# Altium schematic sheet CAL_logics.SchDoc: Calibration logics
size 420 x 297 mm; CheckedBy: K.Belewicz; DrawnBy: G.Kasprowicz; SheetNumber: 2; SheetTotal: 5; ModifiedBy: -; CheckedDate: 12.06.2022; DivGrp: WUT ISE; Designer: G.Kasprowicz
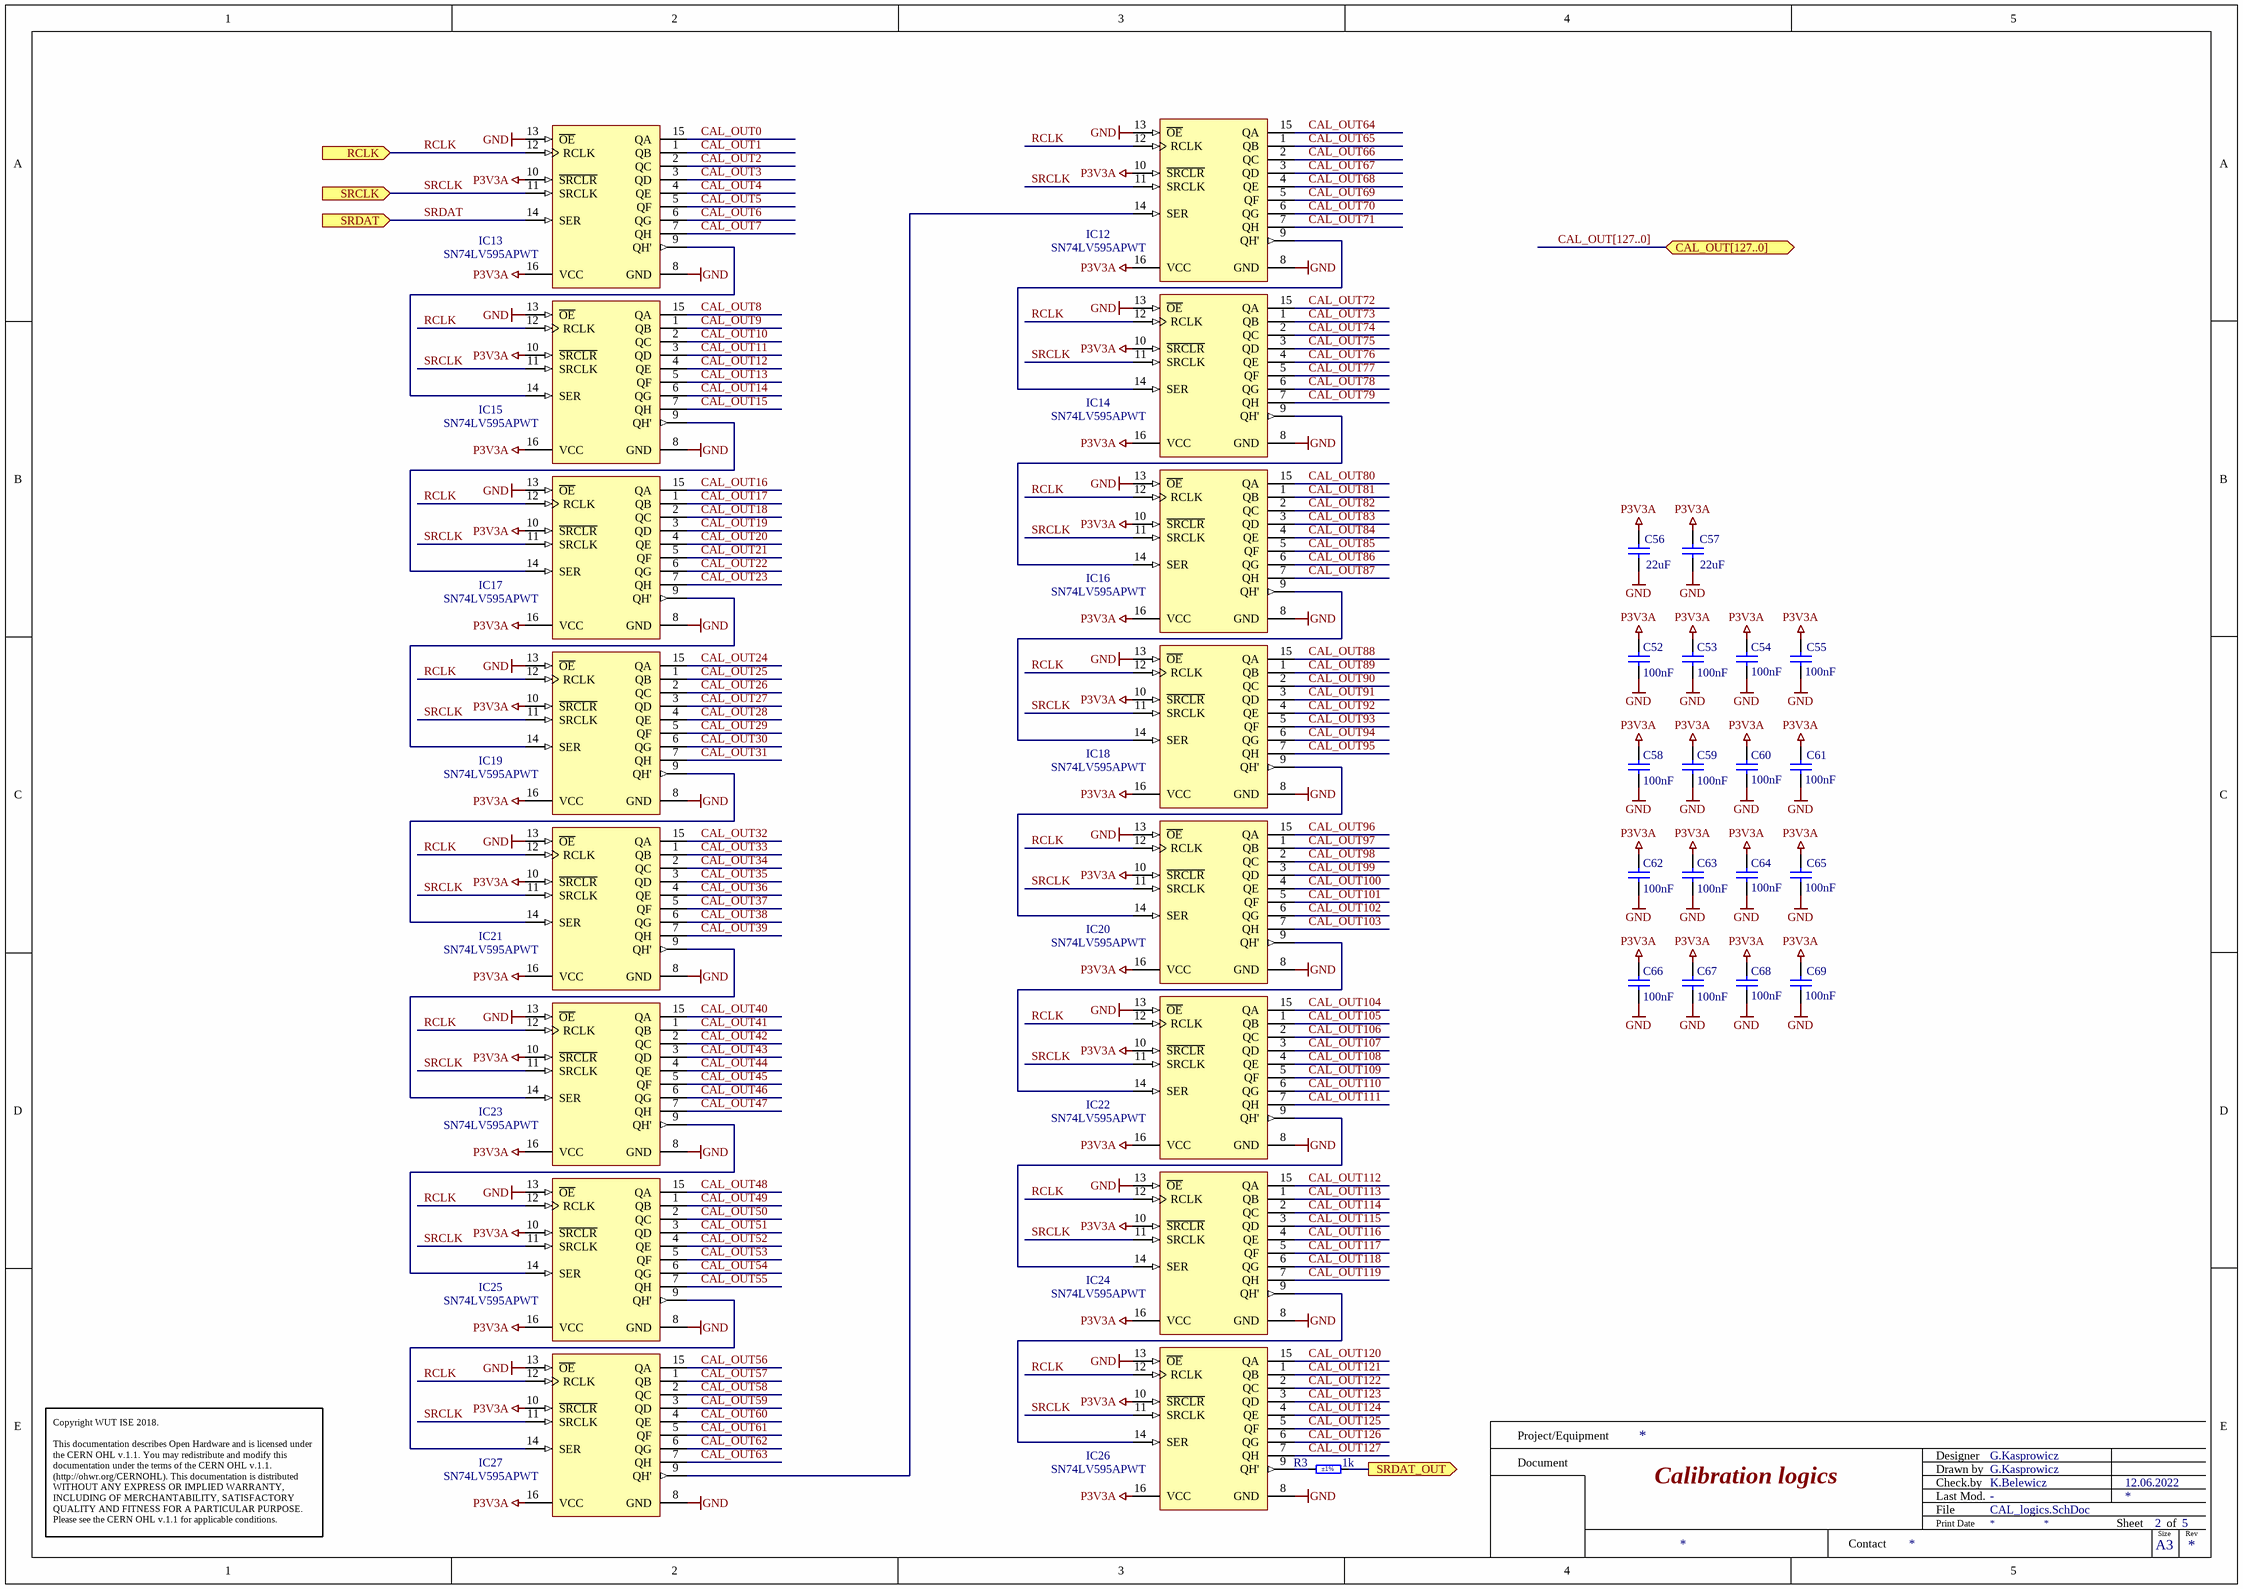
[diagram p0: CAL_logics.SchDoc]

## Parts
C52  100nF  [CAPC1005X55N]
C53  100nF  [CAPC1005X55N]
C54  100nF  [CAPC1005X55N]
C55  100nF  [CAPC1005X55N]
C56  22uF  [CAPC3216X140N]
C57  22uF  [CAPC3216X140N]
C58  100nF  [CAPC1005X55N]
C59  100nF  [CAPC1005X55N]
C60  100nF  [CAPC1005X55N]
C61  100nF  [CAPC1005X55N]
C62  100nF  [CAPC1005X55N]
C63  100nF  [CAPC1005X55N]
C64  100nF  [CAPC1005X55N]
C65  100nF  [CAPC1005X55N]
C66  100nF  [CAPC1005X55N]
C67  100nF  [CAPC1005X55N]
C68  100nF  [CAPC1005X55N]
C69  100nF  [CAPC1005X55N]
IC12  SN74LV595APWT  [SOP65P640X120-16N]
IC13  SN74LV595APWT  [SOP65P640X120-16N]
IC14  SN74LV595APWT  [SOP65P640X120-16N]
IC15  SN74LV595APWT  [SOP65P640X120-16N]
IC16  SN74LV595APWT  [SOP65P640X120-16N]
IC17  SN74LV595APWT  [SOP65P640X120-16N]
IC18  SN74LV595APWT  [SOP65P640X120-16N]
IC19  SN74LV595APWT  [SOP65P640X120-16N]
IC20  SN74LV595APWT  [SOP65P640X120-16N]
IC21  SN74LV595APWT  [SOP65P640X120-16N]
IC22  SN74LV595APWT  [SOP65P640X120-16N]
IC23  SN74LV595APWT  [SOP65P640X120-16N]
IC24  SN74LV595APWT  [SOP65P640X120-16N]
IC25  SN74LV595APWT  [SOP65P640X120-16N]
IC26  SN74LV595APWT  [SOP65P640X120-16N]
IC27  SN74LV595APWT  [SOP65P640X120-16N]
R3  1k  Tolerance: ±1%  [RESC1005X40N]

## Ports
CAL_OUT[127..0] (bidir), RCLK (in), SRCLK (in), SRDAT (in), SRDAT_OUT (out)

## Nets
GND: C52.1 C53.1 C54.1 C55.1 C56.1 C57.1 C58.1 C59.1 C60.1 C61.1 C62.1 C63.1 C64.1 C65.1 C66.1 C67.1 C68.1 C69.1 IC12.8(GND) IC12.13(~{OE}) IC13.8(GND) IC13.13(~{OE}) IC14.8(GND) IC14.13(~{OE}) IC15.8(GND) IC15.13(~{OE}) IC16.8(GND) IC16.13(~{OE}) IC17.8(GND) IC17.13(~{OE}) IC18.8(GND) IC18.13(~{OE}) IC19.8(GND) IC19.13(~{OE}) IC20.8(GND) IC20.13(~{OE}) IC21.8(GND) IC21.13(~{OE}) IC22.8(GND) IC22.13(~{OE}) IC23.8(GND) IC23.13(~{OE}) IC24.8(GND) IC24.13(~{OE}) IC25.8(GND) IC25.13(~{OE}) IC26.8(GND) IC26.13(~{OE}) IC27.8(GND) IC27.13(~{OE})
P3V3A: C52.2 C53.2 C54.2 C55.2 C56.2 C57.2 C58.2 C59.2 C60.2 C61.2 C62.2 C63.2 C64.2 C65.2 C66.2 C67.2 C68.2 C69.2 IC12.10(~{SRCLR}) IC12.16(VCC) IC13.10(~{SRCLR}) IC13.16(VCC) IC14.10(~{SRCLR}) IC14.16(VCC) IC15.10(~{SRCLR}) IC15.16(VCC) IC16.10(~{SRCLR}) IC16.16(VCC) IC17.10(~{SRCLR}) IC17.16(VCC) IC18.10(~{SRCLR}) IC18.16(VCC) IC19.10(~{SRCLR}) IC19.16(VCC) IC20.10(~{SRCLR}) IC20.16(VCC) IC21.10(~{SRCLR}) IC21.16(VCC) IC22.10(~{SRCLR}) IC22.16(VCC) IC23.10(~{SRCLR}) IC23.16(VCC) IC24.10(~{SRCLR}) IC24.16(VCC) IC25.10(~{SRCLR}) IC25.16(VCC) IC26.10(~{SRCLR}) IC26.16(VCC) IC27.10(~{SRCLR}) IC27.16(VCC)
CAL_OUT0: IC13.15(QA)
CAL_OUT1: IC13.1(QB)
CAL_OUT2: IC13.2(QC)
CAL_OUT3: IC13.3(QD)
CAL_OUT4: IC13.4(QE)
CAL_OUT5: IC13.5(QF)
CAL_OUT6: IC13.6(QG)
CAL_OUT7: IC13.7(QH)
CAL_OUT8: IC15.15(QA)
CAL_OUT9: IC15.1(QB)
CAL_OUT10: IC15.2(QC)
CAL_OUT11: IC15.3(QD)
CAL_OUT12: IC15.4(QE)
CAL_OUT13: IC15.5(QF)
CAL_OUT14: IC15.6(QG)
CAL_OUT15: IC15.7(QH)
CAL_OUT16: IC17.15(QA)
CAL_OUT17: IC17.1(QB)
CAL_OUT18: IC17.2(QC)
CAL_OUT19: IC17.3(QD)
CAL_OUT20: IC17.4(QE)
CAL_OUT21: IC17.5(QF)
CAL_OUT22: IC17.6(QG)
CAL_OUT23: IC17.7(QH)
CAL_OUT24: IC19.15(QA)
CAL_OUT25: IC19.1(QB)
CAL_OUT26: IC19.2(QC)
CAL_OUT27: IC19.3(QD)
CAL_OUT28: IC19.4(QE)
CAL_OUT29: IC19.5(QF)
CAL_OUT30: IC19.6(QG)
CAL_OUT31: IC19.7(QH)
CAL_OUT32: IC21.15(QA)
CAL_OUT33: IC21.1(QB)
CAL_OUT34: IC21.2(QC)
CAL_OUT35: IC21.3(QD)
CAL_OUT36: IC21.4(QE)
CAL_OUT37: IC21.5(QF)
CAL_OUT38: IC21.6(QG)
CAL_OUT39: IC21.7(QH)
CAL_OUT40: IC23.15(QA)
CAL_OUT41: IC23.1(QB)
CAL_OUT42: IC23.2(QC)
CAL_OUT43: IC23.3(QD)
CAL_OUT44: IC23.4(QE)
CAL_OUT45: IC23.5(QF)
CAL_OUT46: IC23.6(QG)
CAL_OUT47: IC23.7(QH)
CAL_OUT48: IC25.15(QA)
CAL_OUT49: IC25.1(QB)
CAL_OUT50: IC25.2(QC)
CAL_OUT51: IC25.3(QD)
CAL_OUT52: IC25.4(QE)
CAL_OUT53: IC25.5(QF)
CAL_OUT54: IC25.6(QG)
CAL_OUT55: IC25.7(QH)
CAL_OUT56: IC27.15(QA)
CAL_OUT57: IC27.1(QB)
CAL_OUT58: IC27.2(QC)
CAL_OUT59: IC27.3(QD)
CAL_OUT60: IC27.4(QE)
CAL_OUT61: IC27.5(QF)
CAL_OUT62: IC27.6(QG)
CAL_OUT63: IC27.7(QH)
CAL_OUT64: IC12.15(QA)
CAL_OUT65: IC12.1(QB)
CAL_OUT66: IC12.2(QC)
CAL_OUT67: IC12.3(QD)
CAL_OUT68: IC12.4(QE)
CAL_OUT69: IC12.5(QF)
CAL_OUT70: IC12.6(QG)
CAL_OUT71: IC12.7(QH)
CAL_OUT72: IC14.15(QA)
CAL_OUT73: IC14.1(QB)
CAL_OUT74: IC14.2(QC)
CAL_OUT75: IC14.3(QD)
CAL_OUT76: IC14.4(QE)
CAL_OUT77: IC14.5(QF)
CAL_OUT78: IC14.6(QG)
CAL_OUT79: IC14.7(QH)
CAL_OUT80: IC16.15(QA)
CAL_OUT81: IC16.1(QB)
CAL_OUT82: IC16.2(QC)
CAL_OUT83: IC16.3(QD)
CAL_OUT84: IC16.4(QE)
CAL_OUT85: IC16.5(QF)
CAL_OUT86: IC16.6(QG)
CAL_OUT87: IC16.7(QH)
CAL_OUT88: IC18.15(QA)
CAL_OUT89: IC18.1(QB)
CAL_OUT90: IC18.2(QC)
CAL_OUT91: IC18.3(QD)
CAL_OUT92: IC18.4(QE)
CAL_OUT93: IC18.5(QF)
CAL_OUT94: IC18.6(QG)
CAL_OUT95: IC18.7(QH)
CAL_OUT96: IC20.15(QA)
CAL_OUT97: IC20.1(QB)
CAL_OUT98: IC20.2(QC)
CAL_OUT99: IC20.3(QD)
CAL_OUT100: IC20.4(QE)
CAL_OUT101: IC20.5(QF)
CAL_OUT102: IC20.6(QG)
CAL_OUT103: IC20.7(QH)
CAL_OUT104: IC22.15(QA)
CAL_OUT105: IC22.1(QB)
CAL_OUT106: IC22.2(QC)
CAL_OUT107: IC22.3(QD)
CAL_OUT108: IC22.4(QE)
CAL_OUT109: IC22.5(QF)
CAL_OUT110: IC22.6(QG)
CAL_OUT111: IC22.7(QH)
CAL_OUT112: IC24.15(QA)
CAL_OUT113: IC24.1(QB)
CAL_OUT114: IC24.2(QC)
CAL_OUT115: IC24.3(QD)
CAL_OUT116: IC24.4(QE)
CAL_OUT117: IC24.5(QF)
CAL_OUT118: IC24.6(QG)
CAL_OUT119: IC24.7(QH)
CAL_OUT120: IC26.15(QA)
CAL_OUT121: IC26.1(QB)
CAL_OUT122: IC26.2(QC)
CAL_OUT123: IC26.3(QD)
CAL_OUT124: IC26.4(QE)
CAL_OUT125: IC26.5(QF)
CAL_OUT126: IC26.6(QG)
CAL_OUT127: IC26.7(QH)
RCLK: IC12.12(RCLK) IC13.12(RCLK) IC14.12(RCLK) IC15.12(RCLK) IC16.12(RCLK) IC17.12(RCLK) IC18.12(RCLK) IC19.12(RCLK) IC20.12(RCLK) IC21.12(RCLK) IC22.12(RCLK) IC23.12(RCLK) IC24.12(RCLK) IC25.12(RCLK) IC26.12(RCLK) IC27.12(RCLK) ; port RCLK
SRCLK: IC12.11(SRCLK) IC13.11(SRCLK) IC14.11(SRCLK) IC15.11(SRCLK) IC16.11(SRCLK) IC17.11(SRCLK) IC18.11(SRCLK) IC19.11(SRCLK) IC20.11(SRCLK) IC21.11(SRCLK) IC22.11(SRCLK) IC23.11(SRCLK) IC24.11(SRCLK) IC25.11(SRCLK) IC26.11(SRCLK) IC27.11(SRCLK) ; port SRCLK
SRDAT: IC13.14(SER) ; port SRDAT
SRDAT_OUT: R3.2 ; port SRDAT_OUT
NetIC12_9: IC12.9(QH') IC14.14(SER)
NetIC12_14: IC12.14(SER) IC27.9(QH')
NetIC13_9: IC13.9(QH') IC15.14(SER)
NetIC14_9: IC14.9(QH') IC16.14(SER)
NetIC15_9: IC15.9(QH') IC17.14(SER)
NetIC16_9: IC16.9(QH') IC18.14(SER)
NetIC17_9: IC17.9(QH') IC19.14(SER)
NetIC18_9: IC18.9(QH') IC20.14(SER)
NetIC19_9: IC19.9(QH') IC21.14(SER)
NetIC20_9: IC20.9(QH') IC22.14(SER)
NetIC21_9: IC21.9(QH') IC23.14(SER)
NetIC22_9: IC22.9(QH') IC24.14(SER)
NetIC23_9: IC23.9(QH') IC25.14(SER)
NetIC24_9: IC24.9(QH') IC26.14(SER)
NetIC25_9: IC25.9(QH') IC27.14(SER)
NetIC26_9: IC26.9(QH') R3.1

## Buses and harness runs
bus CAL_OUT[127..0] = port CAL_OUT[127..0]

## Notes on the sheet
- Project/Equipment
- Document
- Designer
- Drawn by
- Check.by
- Copyright WUT ISE 2018.
  This documentation describes Open Hardware and is licensed under the CERN OHL v.1.1. You may redistribute and modify this documentation under the terms of the CERN OHL v.1.1. (http://ohwr.org/CERNOHL). This documentation is distributed WITHOUT ANY EXPRESS OR IMPLIED WARRANTY, INCLUDING OF MERCHANTABILITY, SATISFACTORY QUALITY AND FITNESS FOR A PARTICULAR PURPOSE. Please see the CERN OHL v.1.1 for applicable conditions.
- Contact
- File
- Last Mod.
- Print Date
- Sheet
- Size
- A3
- of
- Rev

## Library data of the parts
C52-C55 C58-C69 = CC0402_100NF_16V_10%_X7R: Non-polarised capacitor; Part Description: SMD Multilayer Chip Ceramic Capacitor; Manufacturer: GENERIC; Manufacturer1 Part Number: GRM155R71C104KA88D; Voltage: 16V; TC: X7R; Tolerance: ±10%; Table: Capacitors SMD; Part Number: CC0402_100NF_16V_10%_X7R; Component Kind: Standard; Component Type: Standard; Pin Count: 2; Value: 100nF; Status: Not Recommended; Manufacturer Part Number: CC0402_100NF_16V_10%_X7R; Case: 0402; Mounted: Yes; Socket: No; SMD: Yes; Manufacturer1 Example: MURATA; Manufacturer1 ComponentHeight: 0.55mm; HelpURL: \\cern.ch\dfs\Applications\Altium\Datasheets\CC0402_X7R_MURATA_GRM.pdf; Author: CERN DEM JLC; CreateDate: 2013-12-05; LatestRevisionDate: 2007-12-03
C56 C57 = CC1206_22UF_6.3V_20%_X5R: Non-polarised capacitor; Part Description: SMD Multilayer Chip Ceramic Capacitor; Manufacturer: GENERIC; Manufacturer1 Part Number: C1206C226K9PAC; Voltage: 6.3V; TC: X5R; Tolerance: ±20%; Table: Capacitors SMD; Part Number: CC1206_22UF_6.3V_20%_X5R; Component Kind: Standard; Component Type: Standard; Pin Count: 2; Value: 22uF; Status: Preferred; Manufacturer Part Number: CC1206_22UF_6.3V_20%_X5R; Case: 1206; Mounted: Yes; Socket: No; SMD: Yes; Manufacturer1 Example: KEMET; Manufacturer1 ComponentHeight: 1.8mm; HelpURL: \\cern.ch\dfs\Applications\Altium\Datasheets\CC1206_X5R_KEMET.pdf; Author: CERN DEM JLC; CreateDate: 2007-12-03; LatestRevisionDate: 2007-12-03
IC12-IC27 = SN74LV595APWT: 8-Bit Shift Register With 3-State Output Register; Part Description: 8-Bit Shift Register With 3-State Output Registers; Manufacturer: TEXAS INSTRUMENTS; PressFit: No; Bonding: No; Part Number: SN74LV595APWT; Component Kind: Standard; Component Type: Standard; Device: SN74LV595APWT; PackageDescription: SOP, 0.65mm Pitch; 16 Pin, 4.40mm W X 5.00mm L X 1.20mm H body, IPC Medium Density; Manufacturer Part Number: SN74LV595APWT; Pin Count: 16; Case: TSSOP16; Mounted: Yes; Socket: No; SMD: Yes; Sense: No; ComponentHeight: 1.2mm; Author: CERN DEM JLC; HelpURL: \\cern.ch\dfs\Applications\Altium\Datasheets\SN74LV595APWT.pdf; CreateDate: 10.05.2012; LatestRevisionDate: 10.05.2012
R3 = R0402_1K_1%_0.0625W_100PPM: Resistor - 1%; Part Description: General Purpose Thick Film Chip Resistor; Manufacturer: GENERIC; Manufacturer1 Part Number: 232270671002L; TC: ±100ppm/°C; PressFit: No; Part Number: R0402_1K_1%_0.0625W_100PPM; Component Kind: Standard; Component Type: Standard; Pin Count: 2; Value: 1k; Status: Not Recommended; Power: 0.0625W; Manufacturer Part Number: R0402_1K_1%_0.0625W_100PPM; Case: 0402; Mounted: Yes; Sense: No; Socket: No; SMD: Yes; Manufacturer1 Example: YAGEO PHYCOMP; Manufacturer1 ComponentHeight: 0.4mm; HelpURL: \\cern.ch\dfs\Applications\Altium\Datasheets\R0402_Phycomp_RC0402.pdf; Author: CERN DEM JLC; CreateDate: 03.12.2007; LatestRevisionDate: 17.10.2012